# EAGLE design Audio-DAC-A (EAGLE 9.6.2)
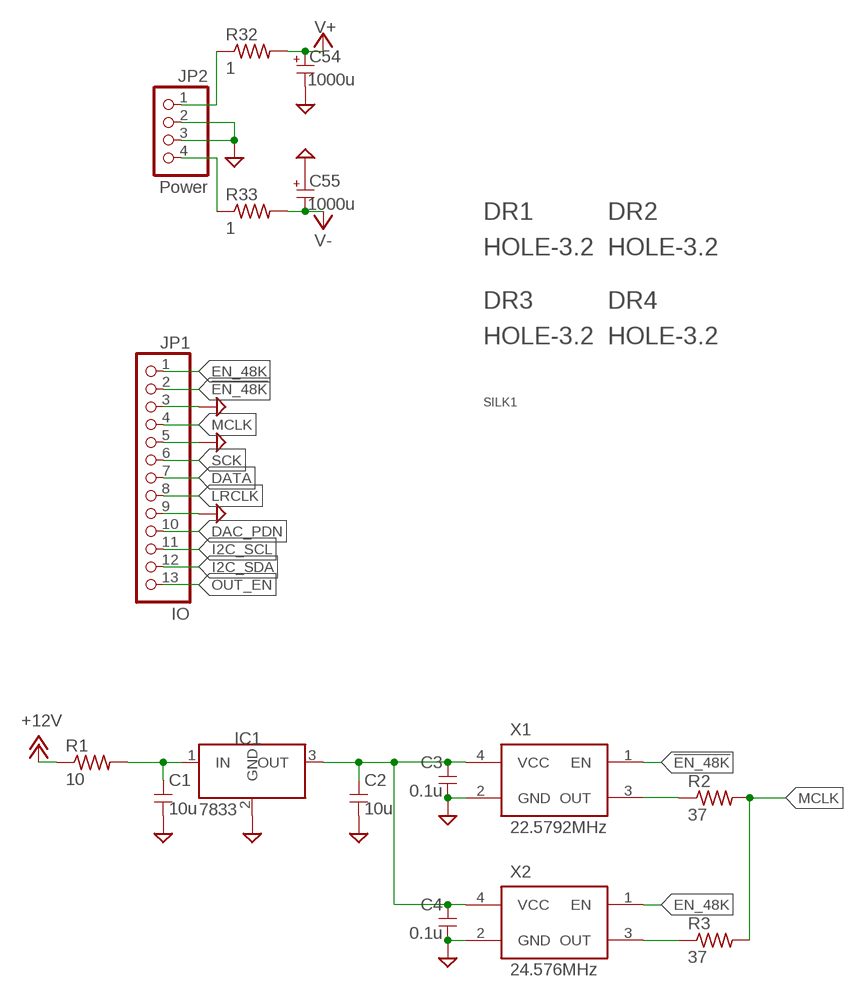
[diagram p0: schematic, sheet 1, part 1 of 2]
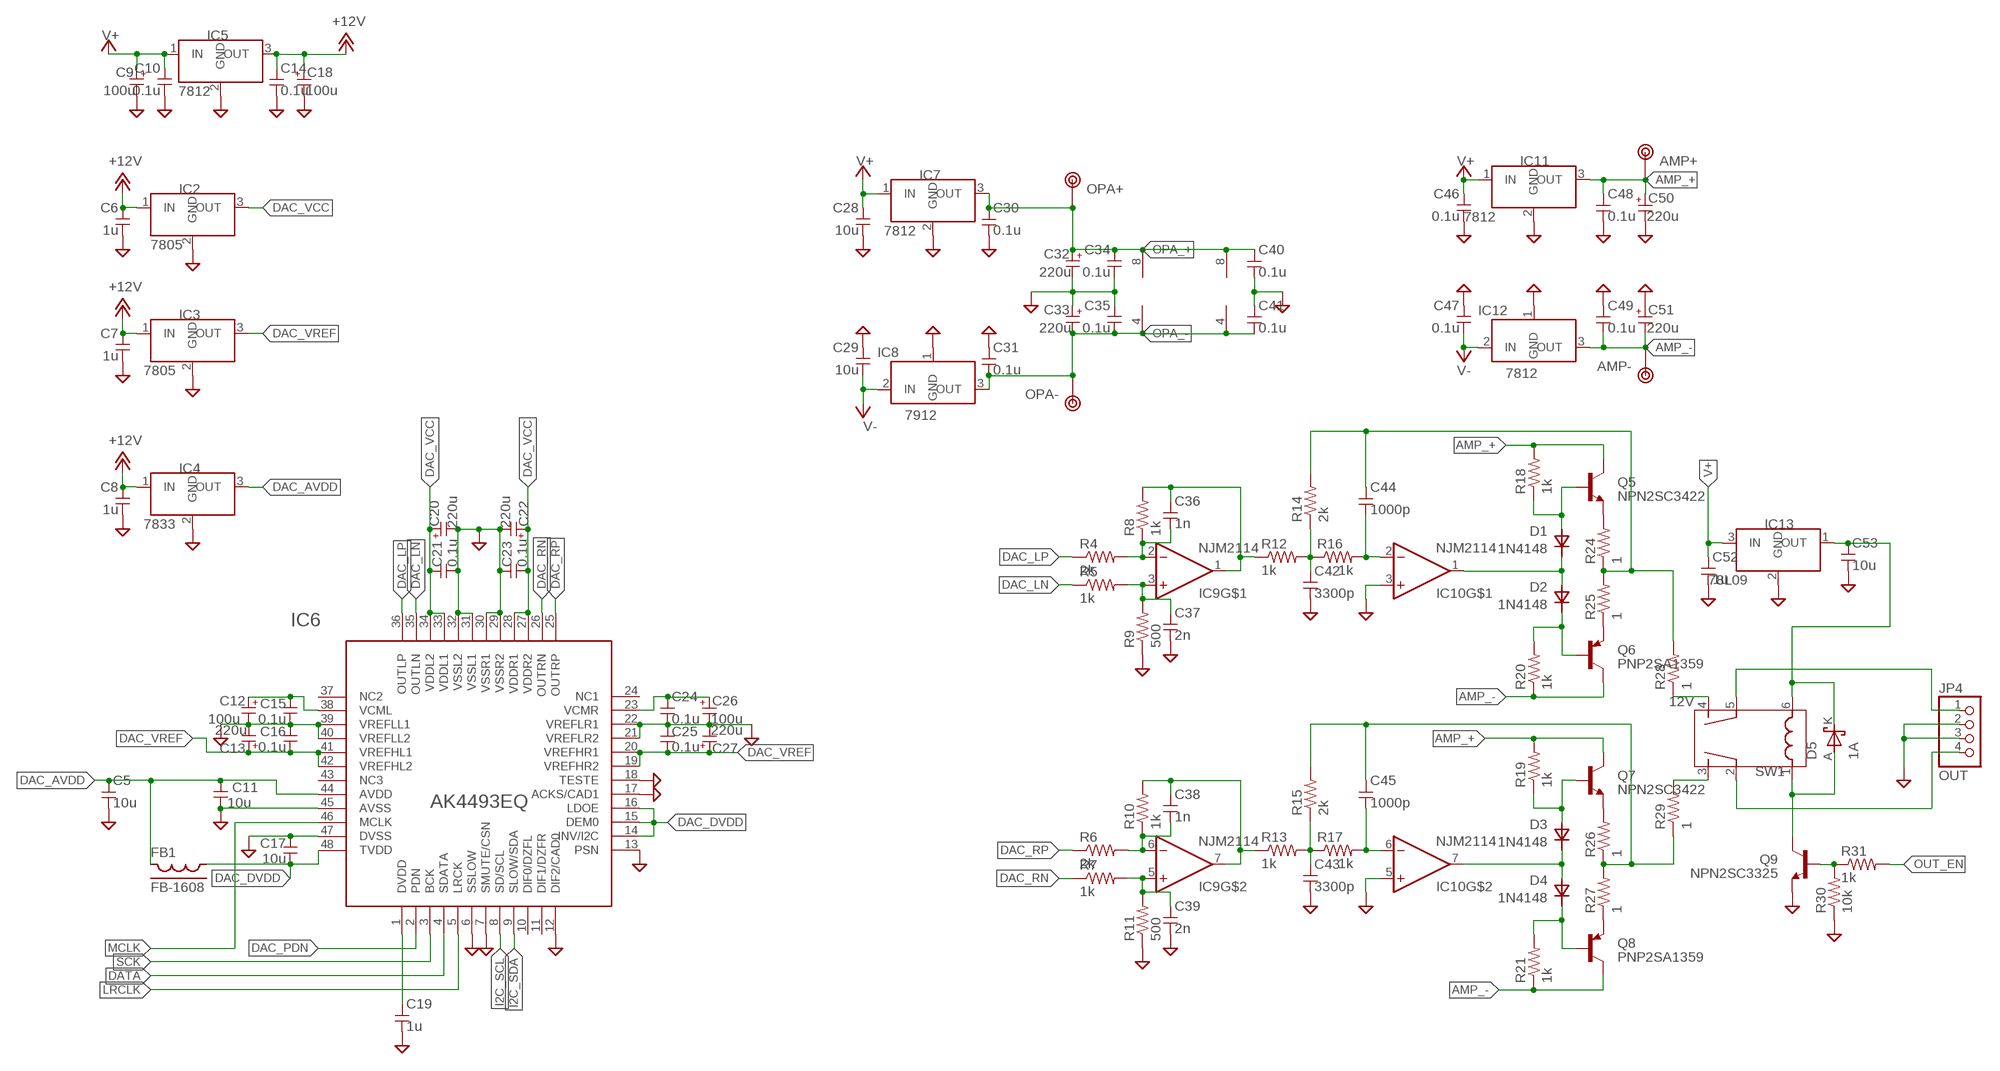
[diagram p1: schematic, sheet 1, part 2 of 2]

## Parts
C1  10u  C-2012  [2012]
C2  10u  C-2012  [2012]
C3  0.1u  C-1608  [1608]
C4  0.1u  C-1608  [1608]
C5  10u  C-2012  [2012]
C6  1u  C-1608  [1608]
C7  1u  C-1608  [1608]
C8  1u  C-1608  [1608]
C9  100u  CPOLE2.5-8  [E2,5-8]
C10  0.1u  C-1608  [1608]
C11  10u  C-1608  [1608]
C12  100u  CPOLE2.5-6.5  [E2.5-6.5]
C13  220u  CPOLE2.5-6.5  [E2.5-6.5]
C14  0.1u  C-1608  [1608]
C15  0.1u  C-1608  [1608]
C16  0.1u  C-1608  [1608]
C17  10u  C-1608  [1608]
C18  100u  CPOLE2.5-8  [E2,5-8]
C19  1u  C-1608  [1608]
C20  220u  CPOLE2.5-6.5  [E2.5-6.5]
C21  0.1u  C-1608  [1608]
C22  220u  CPOLE2.5-6.5  [E2.5-6.5]
C23  0.1u  C-1608  [1608]
C24  0.1u  C-1608  [1608]
C25  0.1u  C-1608  [1608]
C26  100u  CPOLE2.5-6.5  [E2.5-6.5]
C27  220u  CPOLE2.5-6.5  [E2.5-6.5]
C28  10u  C-1608  [1608]
C29  10u  C-1608  [1608]
C30  0.1u  C-1608  [1608]
C31  0.1u  C-1608  [1608]
C32  220u  CPOLE2.5-6.5  [E2.5-6.5]
C33  220u  CPOLE2.5-6.5  [E2.5-6.5]
C34  0.1u  C-1608  [1608]
C35  0.1u  C-1608  [1608]
C36  1n  C-1608  [1608]
C37  2n  C-1608  [1608]
C38  1n  C-1608  [1608]
C39  2n  C-1608  [1608]
C40  0.1u  C-1608  [1608]
C41  0.1u  C-1608  [1608]
C42  3300p  C-1608  [1608]
C43  3300p  C-1608  [1608]
C44  1000p  C-1608  [1608]
C45  1000p  C-1608  [1608]
C46  0.1u  C-1608  [1608]
C47  0.1u  C-1608  [1608]
C48  0.1u  C-1608  [1608]
C49  0.1u  C-1608  [1608]
C50  220u  CPOLE5-10  [E5-10]
C51  220u  CPOLE5-10  [E5-10]
C52  1u  C-1608  [1608]
C53  10u  C-2012  [2012]
C54  1000u  CPOLE5-10  [E5-10]
C55  1000u  CPOLE5-10  [E5-10]
D1  1N4148  DIODE-2  [D0207/2V]
D2  1N4148  DIODE-2  [D0207/2V]
D3  1N4148  DIODE-2  [D0207/2V]
D4  1N4148  DIODE-2  [D0207/2V]
D5  1A  SBD-1A  [TUMD2M]
DR1  HOLE-3.2  [HOLE_3.2]
DR2  HOLE-3.2  [HOLE_3.2]
DR3  HOLE-3.2  [HOLE_3.2]
DR4  HOLE-3.2  [HOLE_3.2]
FB1  FB-1608  [1608]
IC1  7833  78X-1  [7805-LARGEHOLE]
IC2  7805  78X-1  [7805-LARGEHOLE]
IC3  7805  78X-1  [7805-LARGEHOLE]
IC4  7833  78X-1  [7805-LARGEHOLE]
IC5  7812  78X-1  [7805-LARGEHOLE]
IC6  AK4493EQ  [LQFP48]
IC7  7812  78X-1  [7805-LARGEHOLE]
IC8  7912  79X-1  [7805-LARGEHOLE]
IC9  NJM2114  OPA-2'  [DIL08]
IC10  NJM2114  OPA-2'  [DIL08]
IC11  7812  78X-1  [7805-LARGEHOLE]
IC12  7812  79X-1  [7805-LARGEHOLE]
IC13  78L09  78LX  [TO-92]
JP1  IO  PINHD-1X13  [1X13]
JP2  Power  PINHD-1X4  [1X04]
JP4  OUT  PINHD-1X4  [1X04]
Q5  NPN2SC3422  [TO126]
Q6  PNP2SA1359  [TO126]
Q7  NPN2SC3422  [TO126]
Q8  PNP2SA1359  [TO126]
Q9  NPN2SC3325  [SC59]
R1  10  R-7.5  [0204/7]
R2  37  R-1608  [1608]
R3  37  R-1608  [1608]
R4  2k  R-2.5  [0207/2V]
R5  1k  R-2.5  [0207/2V]
R6  2k  R-2.5  [0207/2V]
R7  1k  R-2.5  [0207/2V]
R8  1k  R-2.5  [0207/2V]
R9  500  R-2.5  [0207/2V]
R10  1k  R-2.5  [0207/2V]
R11  500  R-2.5  [0207/2V]
R12  1k  R-2.5  [0207/2V]
R13  1k  R-2.5  [0207/2V]
R14  2k  R-2.5  [0207/2V]
R15  2k  R-2.5  [0207/2V]
R16  1k  R-2.5  [0207/2V]
R17  1k  R-2.5  [0207/2V]
R18  1k  R-2.5  [0207/2V]
R19  1k  R-2.5  [0207/2V]
R20  1k  R-2.5  [0207/2V]
R21  1k  R-2.5  [0207/2V]
R24  1  R-2.5  [0207/2V]
R25  1  R-2.5  [0207/2V]
R26  1  R-2.5  [0207/2V]
R27  1  R-2.5  [0207/2V]
R28  1  R-2.5  [0207/2V]
R29  1  R-2.5  [0207/2V]
R30  10k  R-1608  [1608]
R31  1k  R-7.5  [0204/7]
R32  1  R-10  [0207/10]
R33  1  R-10  [0207/10]
SILK1  ROBOTECHWHEELSILK-9MM  [ROBOTECHWHEEL-9MM]
SW1  12V  ALA2F  [ALA2F]
TP1  AMP+  TESTPIN  [TESTPIN]
TP2  AMP-  TESTPIN  [TESTPIN]
TP3  OPA-  TESTPIN  [TESTPIN]
TP4  OPA+  TESTPIN  [TESTPIN]
X1  22.5792MHz  OSC-KC7050  [KC7050]
X2  24.576MHz  OSC-KC7050  [KC7050]

## Nets
!EN_48K: JP1.2 X1.1(EN)
+12V: C6.1 C7.1 C8.1 C14.1 C18.+ IC2.1(IN) IC3.1(IN) IC4.1(IN) IC5.3(OUT) R1.1
AMP_+: C48.1 C50.+ IC11.3(OUT) Q5.2(C) Q7.2(C) R18.2 R19.2 TP1.1
AMP_-: C49.2 C51.- IC12.3(OUT) Q6.2(C) Q8.2(C) R20.1 R21.1 TP2.1
DAC_AVDD: C5.1 C11.1 FB1.2 IC4.3(OUT) IC6.44(AVDD)
DAC_DVDD: C17.2 FB1.1 IC6.14(INV/I2C) IC6.15(DEM0) IC6.16(LDOE) IC6.48(TVDD)
DAC_LN: IC6.35(OUTLN) R5.1
DAC_LP: IC6.36(OUTLP) R4.1
DAC_PDN: IC6.2(PDN) JP1.10
DAC_RN: IC6.26(OUTRN) R7.1
DAC_RP: IC6.25(OUTRP) R6.1
DAC_VCC: C20.+ C21.1 C22.+ C23.2 IC2.3(OUT) IC6.27(VDDR2) IC6.28(VDDR1) IC6.33(VDDL1) IC6.34(VDDL2)
DAC_VREF: C13.+ C16.2 C25.2 C27.+ IC3.3(OUT) IC6.19(VREFHR2) IC6.20(VREFHR1) IC6.41(VREFHL1) IC6.42(VREFHL2)
DATA: IC6.4(SDATA) JP1.7
EN_48K: JP1.1 X2.1(EN)
GND: C1.2 C2.2 C3.2 C4.2 C5.2 C6.2 C7.2 C8.2 C9.- C10.2 C11.2 C12.- C13.- C14.2 C15.2 C16.1 C17.1 C18.- C19.2 C20.- C21.2 C22.- C23.1 C24.2 C25.1 C26.- C27.- C28.2 C29.1 C30.2 C31.1 C32.- C33.+ C34.2 C35.1 C37.2 C39.2 C40.2 C41.1 C42.2 C43.2 C46.2 C47.1 C48.2 C49.1 C50.- C51.+ C52.2 C53.2 C54.- C55.+ IC1.2(GND) IC2.2(GND) IC3.2(GND) IC4.2(GND) IC5.2(GND) IC6.6(SSLOW) IC6.7(SMUTE/CSN) IC6.12(DIF2/CAD0) IC6.13(PSN) IC6.17(ACKS/CAD1) IC6.18(TESTE) IC6.21(VREFLR2) IC6.22(VREFLR1) IC6.29(VSSR2) IC6.30(VSSR1) IC6.31(VSSL1) IC6.32(VSSL2) IC6.39(VREFLL1) IC6.40(VREFLL2) IC6.45(AVSS) IC6.47(DVSS) IC7.2(GND) IC8.1(GND) IC10.3(+IN) IC10.5(+IN) IC11.2(GND) IC12.1(GND) IC13.2(GND) JP1.3 JP1.5 JP1.9 JP2.2 JP2.3 JP4.2 JP4.3 Q9.2(E) R9.1 R11.1 R30.1 X1.2(GND) X2.2(GND)
I2C_SCL: IC6.8(SD/SCL) JP1.11
I2C_SDA: IC6.9(SLOW/SDA) JP1.12
LRCLK: IC6.5(LRCK) JP1.8
MCLK: IC6.46(MCLK) JP1.4 R2.2 R3.2
N$1: JP2.1 R32.1
N$2: JP2.4 R33.1
N$3: C39.1 IC9.5(+IN) R7.2 R11.2
N$8: D3.1(A) Q7.3(B) R19.1
N$9: D3.2(K) D4.1(A) IC10.7(OUT)
N$10: D4.2(K) Q8.3(B) R21.2
N$13: C12.+ C15.1 IC6.38(VCML)
N$14: R29.2 SW1.3(A1)
N$20: Q7.1(E) R26.2
N$21: C38.2 IC9.6(-IN) R6.2 R10.1
N$22: C19.1 IC6.1(DVDD)
N$23: C24.1 C26.+ IC6.23(VCMR)
N$28: Q8.1(E) R27.1
N$29: C45.1 R15.2 R26.1 R27.2 R29.1
N$30: Q6.1(E) R25.1
N$31: Q5.1(E) R24.2
N$32: C44.1 R14.2 R24.1 R25.2 R28.2
N$41: C38.1 IC9.7(OUT) R10.2 R13.1
N$42: C37.1 IC9.3(+IN) R5.2 R9.2
N$43: C36.2 IC9.2(-IN) R4.2 R8.1
N$44: C36.1 IC9.1(OUT) R8.2 R12.1
N$45: C42.1 R12.2 R14.1 R16.1
N$46: C43.1 R13.2 R15.1 R17.1
N$47: C45.2 IC10.6(-IN) R17.2
N$48: C44.2 IC10.2(-IN) R16.2
N$60: D1.1(A) Q5.3(B) R18.1
N$62: R28.1 SW1.4(A2)
N$63: C53.1 D5.K IC13.1(OUT) SW1.6(L2)
N$64: D2.2(K) Q6.3(B) R20.2
N$65: JP4.4 SW1.2(COM1)
N$66: D5.A Q9.3(C) SW1.1(L1)
N$67: JP4.1 SW1.5(COM2)
N$68: Q9.1(B) R30.2 R31.1
N$75: D1.2(K) D2.1(A) IC10.1(OUT)
N$83: R2.1 X1.3(OUT)
N$86: R3.1 X2.3(OUT)
N$91: C1.1 IC1.1(IN) R1.2
OPA_+: C30.1 C32.+ C34.1 C40.1 IC7.3(OUT) IC9.8(V+) IC10.8(V+) TP4.1
OPA_-: C31.2 C33.- C35.2 C41.2 IC8.3(OUT) IC9.4(V-) IC10.4(V-) TP3.1
OUT_EN: JP1.13 R31.2
SCK: IC6.3(BCK) JP1.6
V+: C9.+ C10.1 C28.1 C46.1 C52.1 C54.+ IC5.1(IN) IC7.1(IN) IC11.1(IN) IC13.3(IN) R32.2
V-: C29.2 C47.2 C55.- IC8.2(IN) IC12.2(IN) R33.2
XTAL_VCC: C2.1 C3.1 C4.1 IC1.3(OUT) X1.4(VCC) X2.4(VCC)
Unconnected: IC6.10(DIF0/DZFL) IC6.11(DIF1/DZFR) IC6.24(NC1) IC6.37(NC2) IC6.43(NC3)

## Library data of the parts
C1-C8 C10 C11 C14-C17 C19 C21 C23-C25 C28-C31 C34-C49 C52 C53 = my_rcl:C
C9 C12 C13 C18 C20 C22 C26 C27 C32 C33 C50 C51 C54 C55 = my_rcl:CPOL
D1-D4 = my_rcl:DIODE
D5 = my_rcl:SBD
DR1-DR4 = my_connector:HOLE-3.2
FB1 = my_rcl:FB
IC1-IC5 IC7 IC11 = my_ic:78X
IC6 = my_ic:AK4493EQ
IC8 IC12 = my_ic:79X
IC9 IC10 = my_ic:OPA-2
IC13 = my_ic:78LX
JP1 = pinhead:PINHD-1X13: PIN HEADER
JP2 JP4 = pinhead:PINHD-1X4: PIN HEADER
Q5 Q7 Q9 = my_ic:NPN
Q6 Q8 = my_ic:PNP
R1-R21 R24-R33 = my_rcl:R
SILK1 = Document_Robotech:ROBOTECHWHEEL
SW1 = my_rcl:ALA2F
TP1-TP4 = my_connector:TESTPIN
X1 X2 = my_rcl:OSC

## Board
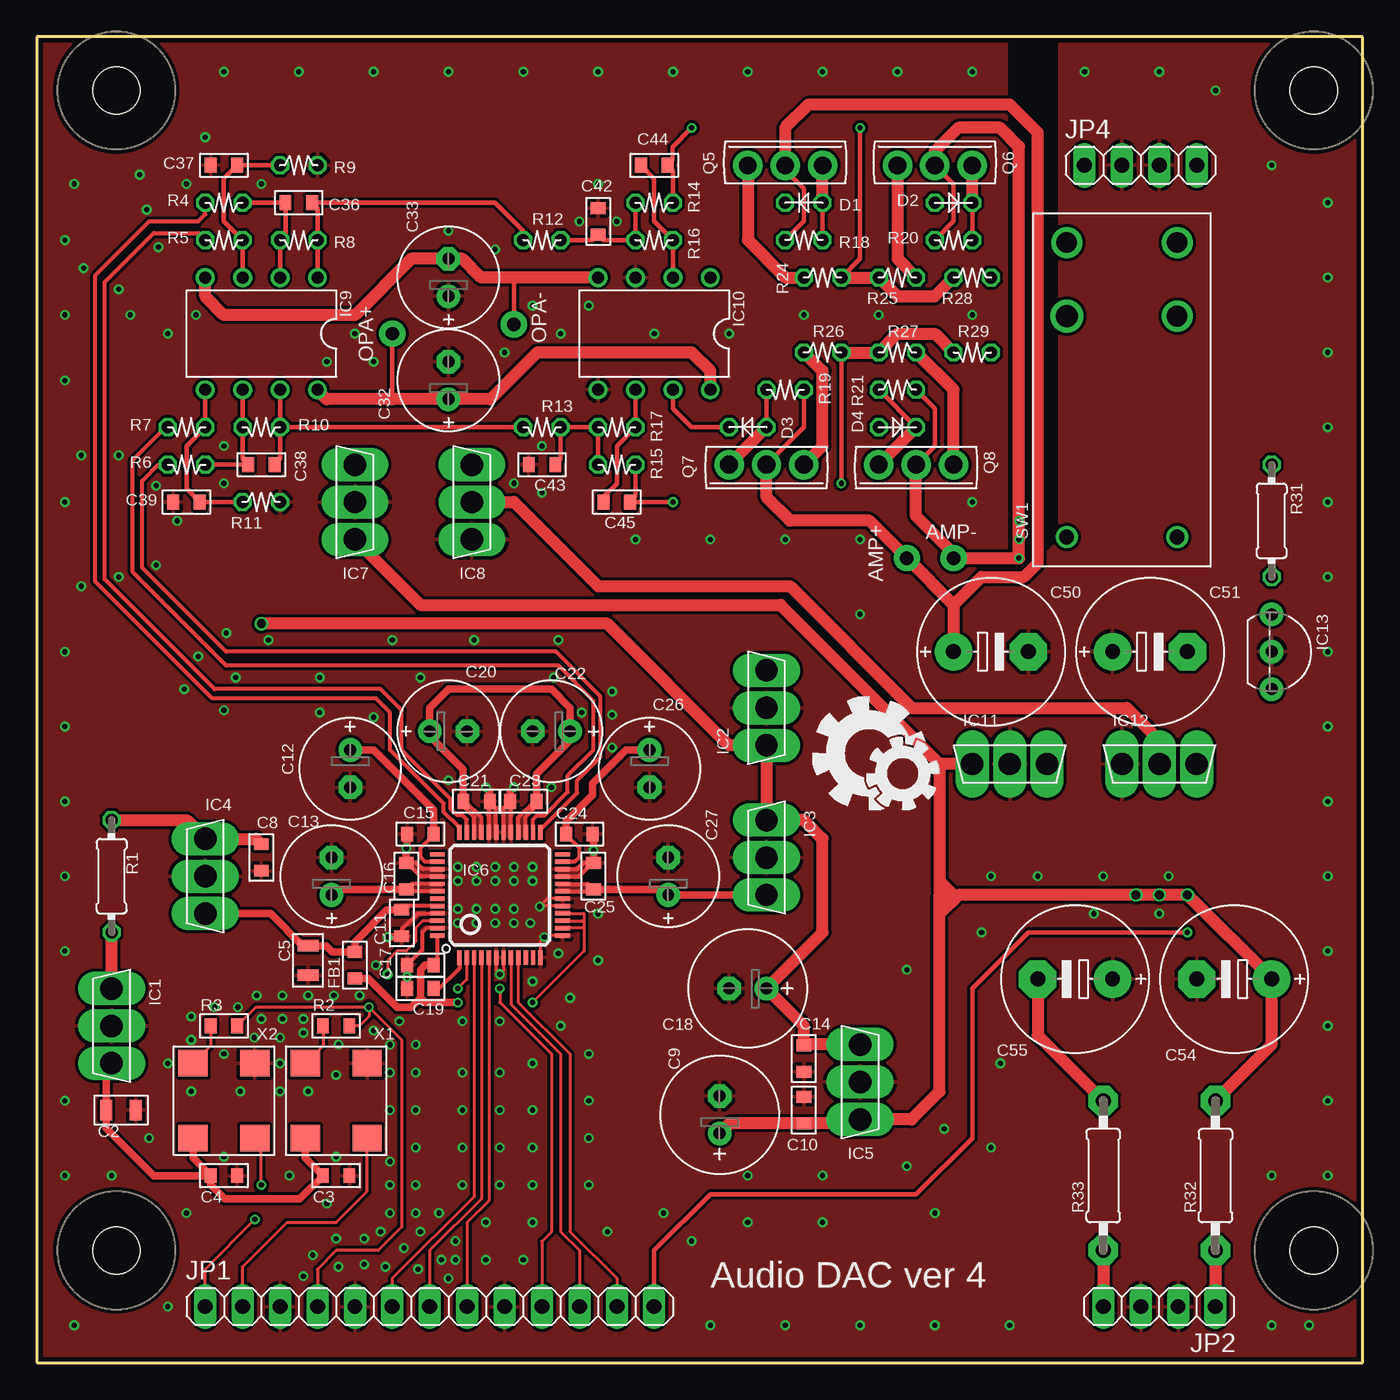
[diagram p2: board, top side]
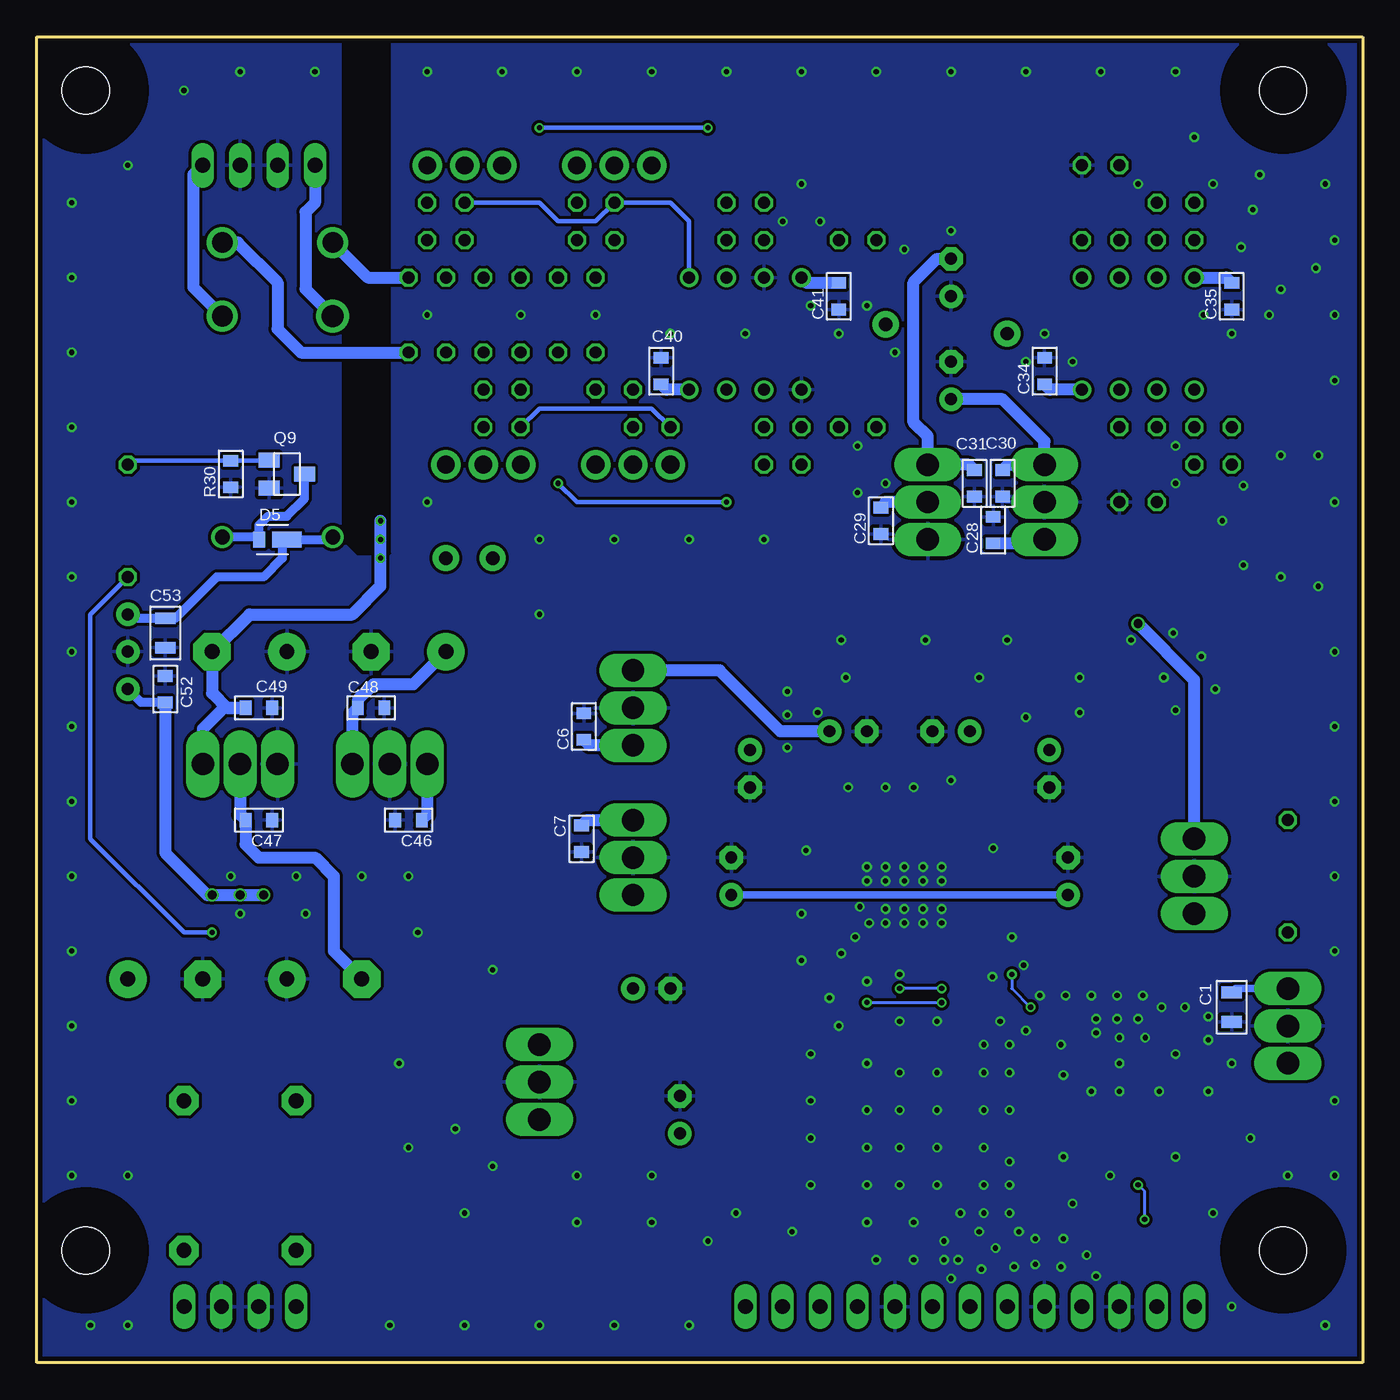
[diagram p3: board, bottom side, seen from below]

Size 90 x 90 mm. Coordinates in mm from the lower left corner, seen from the top.
Outline: 0,0 90,0 90,90 0,90 0,0
Copper layers (1*16): Top 0.035mm / dielectric 1.5mm / Bottom 0.035mm
Design rules "SeeedStudio_2layer_DRU_20140221 *": minimum track width 6mil, minimum drill 0.3mm, track to track 8mil, track to pad 7mil, pad to pad 7mil, via to via 12mil, smd to smd 0mil, copper to edge 0.3mm, drill to drill 10mil, minimum pad ring 0.15mm, minimum via ring 6mil, stop-mask expansion 2mil, vias tented up to drill 1mm, thermal gap 10mil
tRestrict: 12 lines

### Footprints (pad centres in the part's own frame; a part is rotated, then mirrored left to right if it is on the bottom)
2012 = smd 0.8 x 1.4: 1 -1,0; 2 1,0
1608 = smd 0.8 x 1: 1 -0.9,0; 2 0.9,0
E2,5-8 = drill 0.813 pad 1.6: + -1.27,0 | drill 0.813 pad 1.6 octagon: - 1.27,0
E2.5-6.5 = drill 0.813 pad 1.6: + -1.27,0 | drill 0.813 pad 1.6 octagon: - 1.27,0
E5-10 = drill 1.016 pad 2.54: + -2.54,0 | drill 1.016 pad 2.54 octagon: - 2.54,0
D0207/2V = drill 0.813 octagon: 1 -1.27,0; 2 1.27,0
TUMD2M = smd 0.8 x 1.1: A -1.25,0 | smd 2 x 1.1: K 0.65,0
HOLE_3.2 = hole 3.2: 0,0
7805-LARGEHOLE = drill 1.524 pad 2.032 long: 1 -2.54,0; 2 0,0; 3 2.54,0
LQFP48 = smd 0.3 x 1: 1 -2.75,-4.25; 2 -2.25,-4.25; 3 -1.75,-4.25; 4 -1.25,-4.25; 5 -0.75,-4.25; 6 -0.25,-4.25; 7 0.25,-4.25; 8 0.75,-4.25; 9 1.25,-4.25; 10 1.75,-4.25; 11 2.25,-4.25; 12 2.75,-4.25; 25 2.75,4.25; 26 2.25,4.25; 27 1.75,4.25; 28 1.25,4.25; 29 0.75,4.25; 30 0.25,4.25; 31 -0.25,4.25; 32 -0.75,4.25; 33 -1.25,4.25; 34 -1.75,4.25; 35 -2.25,4.25; 36 -2.75,4.25 | smd 1 x 0.3: 13 4.25,-2.75; 14 4.25,-2.25; 15 4.25,-1.75; 16 4.25,-1.25; 17 4.25,-0.75; 18 4.25,-0.25; 19 4.25,0.25; 20 4.25,0.75; 21 4.25,1.25; 22 4.25,1.75; 23 4.25,2.25; 24 4.25,2.75; 37 -4.25,2.75; 38 -4.25,2.25; 39 -4.25,1.75; 40 -4.25,1.25; 41 -4.25,0.75; 42 -4.25,0.25; 43 -4.25,-0.25; 44 -4.25,-0.75; 45 -4.25,-1.25; 46 -4.25,-1.75; 47 -4.25,-2.25; 48 -4.25,-2.75
DIL08 = drill 0.813 pad 1.27: 1 -3.81,-3.81; 2 -1.27,-3.81; 3 1.27,-3.81; 4 3.81,-3.81; 5 3.81,3.81; 6 1.27,3.81; 7 -1.27,3.81; 8 -3.81,3.81
TO-92 = drill 0.813 pad 1.6: 1 -2.54,0; 2 0,0; 3 2.54,0
1X13 = drill 1.016 long: 1 -15.24,0; 2 -12.7,0; 3 -10.16,0; 4 -7.62,0; 5 -5.08,0; 6 -2.54,0; 7 0,0; 8 2.54,0; 9 5.08,0; 10 7.62,0; 11 10.16,0; 12 12.7,0; 13 15.24,0
1X04 = drill 1.016 long: 1 -3.81,0; 2 -1.27,0; 3 1.27,0; 4 3.81,0
TO126 = drill 1.2 pad 2: 1 -2.54,0; 2 0,0; 3 2.54,0
SC59 = smd 1 x 1.4: 1 -0.95,-1.2; 2 0.95,-1.2; 3 0,1.2
0204/7 = drill 0.813 octagon: 1 -3.81,0; 2 3.81,0
0207/2V = drill 0.813 octagon: 1 -1.27,0; 2 1.27,0
0207/10 = drill 1 pad 2 octagon: 1 -5.08,0; 2 5.08,0
ALA2F = drill 1: 1 -10,-3.75; 6 -10,3.75 | drill 1.4: 2 5,-3.75; 3 10,-3.75; 4 10,3.75 | drill 1.5: 5 5,3.75
TESTPIN = drill 0.9 pad 1.778: 1 0,0
KC7050 = smd 1.8 x 2: 1 -2.54,-2.1; 2 2.54,-2.1; 3 2.54,2.1; 4 -2.54,2.1

### Placement (x,y rotation side)
C1  8.89,24.13 270 bottom
C2  5.71,17.14 0 top
C3  20.32,12.7 0 top
C4  12.7,12.7 0 top
C5  18.41,27.3 270 top
C6  52.86,43.18 90 bottom
C7  53.02,35.56 270 bottom
C8  15.24,34.29 270 top
C9  46.35,16.83 90 top
C10  52.07,17.14 90 top
C11  24.77,29.84 270 top
C12  21.27,40.32 270 top
C13  20,33.02 90 top
C14  52.07,20.64 270 top
C15  26.04,35.88 180 top
C16  25.08,33.02 270 top
C17  26.04,26.99 0 top
C18  48.26,25.4 180 top
C19  26.04,25.4 180 top
C20  27.94,42.86 0 top
C21  29.84,38.1 0 top
C22  34.92,42.86 180 top
C23  33.02,38.1 0 top
C24  36.83,35.88 0 top
C25  37.78,33.02 270 top
C26  41.59,40.32 270 top
C27  42.86,33.02 90 top
C28  25.08,56.52 90 bottom
C29  32.7,57.15 90 bottom
C30  24.45,59.69 270 bottom
C31  26.35,59.69 90 bottom
C32  27.94,66.67 90 top
C33  27.94,73.66 90 top
C34  21.59,67.31 90 bottom
C35  8.89,72.39 90 bottom
C36  17.78,78.74 180 top
C37  12.7,81.28 180 top
C38  15.24,60.96 180 top
C39  10.16,58.42 180 top
C40  47.62,67.31 90 bottom
C41  35.56,72.39 90 bottom
C42  38.1,77.47 90 top
C43  34.29,60.96 180 top
C44  41.91,81.28 180 top
C45  39.37,58.42 180 top
C46  64.77,36.83 180 bottom
C47  74.93,36.83 180 bottom
C48  67.31,44.45 0 bottom
C49  74.93,44.45 180 bottom
C50  64.77,48.26 0 top
C51  75.56,48.26 0 top
C52  81.28,45.72 90 bottom
C53  81.28,49.53 270 bottom
C54  81.28,26.04 180 top
C55  70.48,26.04 180 top
D1  52.07,78.74 180 top
D2  62.23,78.74 0 top
D3  48.26,63.5 180 top
D4  58.42,63.5 0 top
D5  73.66,55.88 0 bottom
DR1  5.4,7.62 0 top
DR2  86.68,7.62 0 top
DR3  5.4,86.36 0 top
DR4  86.68,86.36 0 top
FB1  21.59,26.99 90 top
IC1  5.08,22.86 270 top
IC2  49.53,44.45 90 top
IC3  49.53,34.29 270 top
IC4  11.43,33.02 270 top
IC5  55.88,19.05 90 top
IC6  31.43,31.75 0 top
IC7  21.59,58.42 90 top
IC8  29.53,58.42 90 top
IC9  15.24,69.85 180 top
IC10  41.91,69.85 180 top
IC11  66.04,40.64 0 top
IC12  76.2,40.64 0 top
IC13  83.82,48.26 270 top
JP1  26.67,3.81 0 top
JP2  76.2,3.81 180 top
JP4  74.93,81.28 0 top
Q5  50.8,81.28 0 top
Q6  60.96,81.28 0 top
Q7  49.53,60.96 180 top
Q8  59.69,60.96 180 top
Q9  73.03,60.33 270 bottom
R1  5.08,33.02 270 top
R2  20.32,22.86 0 top
R3  12.7,22.86 0 top
R4  12.7,78.74 0 top
R5  12.7,76.2 0 top
R6  10.16,60.96 0 top
R7  10.16,63.5 0 top
R8  17.78,76.2 0 top
R9  17.78,81.28 180 top
R10  15.24,63.5 0 top
R11  15.24,58.42 180 top
R12  34.29,76.2 0 top
R13  34.29,63.5 0 top
R14  41.91,78.74 0 top
R15  39.37,60.96 0 top
R16  41.91,76.2 0 top
R17  39.37,63.5 0 top
R18  52.07,76.2 180 top
R19  50.8,66.04 0 top
R20  62.23,76.2 0 top
R21  58.42,66.04 180 top
R24  53.34,73.66 180 top
R25  58.42,73.66 180 top
R26  53.34,68.58 180 top
R27  58.42,68.58 180 top
R28  63.5,73.66 180 top
R29  63.5,68.58 0 top
R30  76.83,60.33 90 bottom
R31  83.82,57.15 270 top
R32  80.01,12.7 90 top
R33  72.39,12.7 90 top
SILK1  52.55,37.31 0 top
SW1  73.66,66.04 90 top
TP1  59.05,54.61 0 top
TP2  62.23,54.61 0 top
TP3  32.38,70.48 0 top
TP4  24.13,69.85 0 top
X1  20.32,17.78 90 top
X2  12.7,17.78 90 top

### Tracks (layer width: path | path; a pad name or v marks a point on that pad's centre or on a via)
!EN_48K
  Top 0.203: JP1.2 13.97,6.51 16.99,9.53 20.32,9.53 22.42,11.62 X1.1
+12V  (via drill 0.6)
  Top 0.813: R1.1 10.16,36.83 IC4.1 14.87,35.56 C8.1 | v15.24,50.16 38.73,50.16 46.99,41.91 IC2.1 IC3.1 52.07,36.83 53.34,35.56 53.34,29.21 C18.+ 52.07,22.86 C14.1 52.12,21.59 IC5.3
  Bottom 0.813: IC4.1 11.43,46.35 v15.24,50.16 | C7.1 52.65,36.83 IC3.1 | IC2.1 52.49,41.91 C6.1
AMP_+
  Top 0.305: Q5.2 50.8,80.96 52.07,79.69 52.07,77.47 R18.2 | R19.2 52.07,63.5 Q7.2
  Top 0.813: Q7.2 49.53,58.74 51.12,57.15 56.52,57.15 TP1.1 62.23,51.44 | Q5.2 50.8,83.82 52.39,85.41 66.04,85.41 67.94,83.5 67.94,54.29 66.99,53.34 64.14,53.34 62.23,51.44 | 62.23,51.44 C50.+
  Bottom 0.813: IC11.3 68.58,44.08 C48.1 68.21,44.98 67.15,46.04 64.45,46.04 C50.+
AMP_-  (via drill 0.35)
  Top 0.305: R20.1 62.23,77.47 62.23,80.01 Q6.2 | R21.1 60.96,64.77 60.96,62.23 Q8.2
  Top 0.813: Q8.2 59.69,57.47 62.23,54.93 TP2.1 v66.67,54.61 v66.67,55.88 v66.67,57.15 66.67,82.55 65.41,83.82 62.55,83.82 60.96,82.23 Q6.2
  Bottom 0.813: IC12.3 78.74,43.02 77.31,44.45 C49.2 77.1,44.45 78.11,45.45 C51.- 75.56,50.8 68.58,50.8 66.67,52.7 v66.67,54.61 v66.67,55.88 v66.67,57.15
DAC_AVDD
  Top 0.279: IC6.44 24.97,31 24.77,30.8 C11.1
  Top 0.508: C11.1 23.76,30.75 21.59,28.57 FB1.2 20.05,27.89 19.64,28.3 C5.1 18.05,28.3 15.88,30.48 IC4.3
DAC_DVDD  (via drill 0.35)
  Top 0.203: IC6.14 37.12,29.5 37.15,29.53 | IC6.16 37.13,30.5 37.15,30.48 37.15,29.84 | 37.15,29.84 37.15,29.53 | IC6.15 36.99,30 37.15,29.84 | v33.66,24.45 37.15,27.94 37.15,29.53
  Top 0.279: IC6.48 27.18,27.23
  Top 0.305: 27.18,27.23 C17.2
  Top 0.508: C17.2 26.35,26.99 26.04,26.67 26.04,24.77 | 26.04,24.77 25.4,24.13 24.45,24.13 22.49,26.09 FB1.1 | v28.57,24.44 26.36,24.44 26.04,24.77
  Bottom 0.203: v28.57,24.44 28.58,24.45 v33.66,24.45
DAC_LN
  Top 0.279: IC6.35 29.18,36.86 28.89,37.15 28.55,37.15 28.1,37.6 28.1,38.26 24.77,41.59 24.77,44.29 23.34,45.72 12.06,45.72 4.6,53.18 4.6,73.34 7.94,76.68 10.95,76.68 R5.1
DAC_LP
  Top 0.279: IC6.36 28.68,36.33 27.62,37.4 27.62,37.95 23.97,41.59 23.97,44.13 23.02,45.09 11.91,45.09 3.97,53.02 3.97,73.82 7.62,77.47 10.95,77.47 11.43,77.95 R4.1
DAC_PDN  (via drill 0.35)
  Top 0.203: IC6.2 29.18,26.01 v28.57,25.4 | v31.43,25.4 31.43,24.45 34.92,20.95 34.92,8.89 34.29,8.26 JP1.10
  Bottom 0.203: v28.57,25.4 v31.43,25.4
DAC_RN
  Top 0.279: IC6.26 33.68,36.86 33.97,37.15 34.45,37.15 36.04,38.73 36.04,39.85 37.78,41.59 37.78,44.93 35.4,47.31 12.86,47.31 6.51,53.66 6.51,61.28 8.73,63.5 R7.1
DAC_RP
  Top 0.279: IC6.25 34.18,36.2 36.67,38.69 36.67,39.53 38.27,41.12 38.27,45.24 35.24,48.26 12.86,48.26 7.14,53.98 7.14,59.85 8.26,60.96 R6.1
DAC_VCC
  Top 0.279: IC6.34 29.68,37.05 28.95,37.78 C21.1 29.08,38.1 30.18,37 IC6.33 | IC6.27 33.18,37.05 33.92,37.78 C23.2 33.79,38.1 32.68,37 IC6.28
  Top 0.508: C21.1 28.95,40.27 26.67,42.55 C20.+ 26.67,44.45 27.94,45.72 34.92,45.72 36.2,44.45 C22.+ 36.2,42.23 33.92,39.95 C23.2
  Bottom 0.813: C22.+ 39.53,42.86 43.66,46.99 IC2.3
  pour Top (no thermals): 32.7,35.72 33.18,35.72 33.18,37.15 33.66,37.62 33.5,37.62 33.34,37.62 32.7,36.99 32.7,35.88
  pour Top (no thermals): 29.69,35.72 30,35.72 30,37.15 29.37,37.78 29.05,37.78 29.69,37.15
DAC_VREF
  Top 0.279: IC6.41 25.46,32.5 C16.2 25.2,32 IC6.42 | IC6.19 37.66,32 C25.2 37.4,32.5 IC6.20
  Top 0.508: C16.2 20.37,32.12 C13.+ | C25.2 42.49,32.12 C27.+ IC3.3
  Bottom 0.508: C27.+ 35.56,31.75 C13.+
  pour Top (no thermals): 27.46,32.07 27.46,32.38 25.56,32.38 25.56,32.07
  pour Top (no thermals): 35.4,32.38 35.4,32.07 37.31,32.07 37.31,32.38
DATA
  Top 0.203: IC6.4 30.18,11.13 26.67,7.62 JP1.7
EN_48K  (via drill 0.35)
  Top 0.203: JP1.1 11.43,6.35 v14.8,9.72 | v15.24,12.06 15.24,14.8 X2.1
  Bottom 0.203: v14.8,9.72 14.8,11.62 v15.24,12.06
GND  (via drill 0.35)
  Top 0.203: IC6.17 34.17,31 | 34.17,31 v34.13,30.96 | IC6.18 34.67,31.5 34.17,31 | IC6.13 34.56,29 v34.45,28.89 34.18,28.63 IC6.12 | IC6.7 31.68,26.6 v31.43,26.35 | v31.43,26.35 v31.43,26.36 | IC6.6 31.18,26.6 v31.43,26.35
  Top 0.279: IC6.45 27.15,30.47 25.84,30.47 24.77,29.4 24.77,29.21 | IC6.47 26.45,29.5 26.16,29.21 26.16,28.02 C17.1 | IC6.39 26.19,33.5 25.72,33.97 25.4,33.97 | 25.4,33.97 25.14,33.97 C16.1 | IC6.40 26.05,33 25.4,33.66 25.4,33.97 | IC6.21 36.81,33 37.73,33.92 C25.1 37.73,33.97 37.15,33.97 36.67,33.5 IC6.22 | IC6.32 30.68,38.04 C21.2 31.18,37.66 IC6.31 | IC6.30 31.68,37.66 C23.1 32.18,38.04 IC6.29
  Top 0.305: 24.77,29.21 C11.2
  Top 0.508: C21.2 30.75,38.79 v30.48,39.05 | C23.1 32.12,38.79 v32.38,39.05 | C16.1 v25.08,34.92 25.14,34.98 C15.2 | C11.2 24.71,28.89 v23.81,28.89 | C17.1 v25.14,26.19 C19.2 | C25.1 v37.78,34.77 37.78,35.83 C24.2
  other vias: 29.84,33.66 31.11,33.66 32.38,33.66 32.38,32.7 31.11,32.7 29.84,32.7 29.84,30.8 31.11,30.8 32.38,30.8 32.38,29.84 31.11,29.84 29.84,29.84 33.66,33.66 33.66,32.7 28.57,33.66 28.57,32.7 28.57,30.8 28.57,29.84 33.5,29.84 35.4,27.78 33.66,25.88 31.43,23.18 31.43,19.68 31.43,17.14 31.43,14.61 31.43,12.06 30.48,9.53 30.48,6.99 28.42,6.99 28.42,8.26 27.46,6.99 25.88,6.35 28.89,23.18 28.89,19.68 28.89,17.14 28.89,14.61 28.89,12.06 27.3,10.16 26.04,8.89 24.92,7.78 23.65,6.51 23.02,26.99 21.91,24.92 24.61,23.18 22.86,22.54 25.72,21.59 25.72,19.68 25.72,17.14 25.72,14.61 25.72,12.06 25.72,10.16 23.97,21.59 23.97,19.68 23.97,17.14 23.97,13.65 23.97,12.06 23.97,10.16 23.34,8.89 22.23,8.41 22.23,6.67 20.48,6.51 20.32,8.41 18.73,7.3 18.1,5.87 27.94,5.71 18.1,22.38 20.16,24.92 18.41,24.92 16.67,24.92 14.92,24.92 13.65,24.13 15.24,23.34 16.67,23.34 18.1,23.34 20.48,21.59 20.32,19.53 18.41,18.41 16.51,18.41 16.51,22.07 13.81,18.41 12.7,20.95 10.48,18.41 16.51,20.32 8.89,20.32 10.48,21.91 10.48,23.5 12.06,24.13 14.76,22.07 36.99,44.13 35.08,46.51 26.04,46.51 19.21,46.51 13.49,46.51 10.95,47.94 5.56,53.34 5.56,61.59 5.56,72.87 8.26,75.72 7.46,78.26 3.17,74.3 3.02,61.59 3.02,52.7 10,45.72 12.7,44.29 19.21,44.13 22.86,43.81 27.94,39.53 34.92,39.05 39.05,41.75 39.05,43.97 39.05,45.56 35.4,49.05 29.69,49.05 24.13,49.05 15.72,49.05 12.86,49.53 8.1,54.13 8.1,59.53 33.66,12.06 33.66,9.53 33.02,6.99 37.47,12.06 33.66,14.61 33.66,17.14 33.66,20.32 35.56,22.86 37.47,20.95 37.47,17.78 37.47,15.24 38.73,8.89 42.55,10.16 44.45,8.26 48.26,12.7 48.26,9.53 53.34,9.53 53.34,12.7 59.05,13.34 60.96,10.16 64.77,14.61 61.59,15.88 65.41,20.32 59.05,26.67 9.53,57.15 12.7,59.69 12.7,62.23 19.68,67.94 21.59,69.85 6.35,71.12 8.89,69.85 10.79,71.12 10.16,80.01 11.43,83.19 15.24,80.01 71.75,30.48 76.2,30.48 64.14,29.21 72.39,33.02 76.83,33.02 67.94,33.02 64.77,33.02 33.66,71.75 31.75,68.58 22.86,67.94 27.94,76.83 31.11,75.56 35.56,69.85 37.47,71.75 40.64,55.88 34.29,59.05 32.38,59.69 34.29,62.23 39.37,77.47 38.1,80.01 36.83,77.47 8.89,3.81 45.72,2.54 50.8,2.54 55.88,2.54 60.96,2.54 66.04,2.54 83.82,2.54 86.36,2.54 83.82,12.7 87.63,12.7 87.63,17.78 87.63,22.86 87.63,27.94 87.63,33.02 87.63,38.1 87.63,43.18 87.63,48.26 87.63,53.34 87.63,58.42 87.63,63.5 87.63,68.58 87.63,73.66 87.63,78.74 83.82,81.28 80.01,86.36 76.2,87.63 71.12,87.63 63.5,87.63 58.42,87.63 53.34,87.63 48.26,87.63 43.18,87.63 38.1,87.63 33.02,87.63 27.94,87.63 22.86,87.63 17.78,87.63 12.7,87.63 6.99,80.64 2.54,80.01 1.91,76.2 1.91,71.12 1.91,66.67 1.91,58.42 1.91,48.26 1.91,43.18 1.91,38.1 1.91,33.02 1.91,27.94 1.91,17.78 1.91,12.7 5.08,12.7 10.16,10.16 2.54,2.54 41.91,69.85 46.99,69.85 52.07,71.12 57.15,71.12 63.5,71.12 63.5,58.42 45.72,55.88 50.8,55.88 55.88,55.88 55.88,50.8 19.68,10.79 12.7,13.97 20.32,13.97 17.14,12.7 7.62,15.24 36.2,24.77 38.1,27.3 38.1,30.48
  pour Bottom (isolate 0.203, rank 6): 0,90.17 0,0 90.17,0 90.17,90.17
  pour Top (isolate 0.203, rank 6): 0,0 0,90.17 90.17,90.17 90.17,0
  pour Top (no thermals): 27.46,33.02 27.46,33.5 26.04,33.5 25.72,33.81 25.4,33.81 26.19,33.02
  pour Top (no thermals): 35.4,33.5 35.4,33.02 36.83,33.02 37.62,33.81 37.15,33.81 36.83,33.5
  pour Top (no thermals): 31.75,35.72 32.07,35.72 32.07,37.62 31.75,37.62
  pour Top (no thermals): 30.8,35.72 31.11,35.72 31.11,37.62 30.8,37.62 30.8,35.88
  cutout Bottom: 66.04,90.81 69.22,90.81 69.22,55.88 68.26,54.93 66.04,54.93
  cutout Top: 66.04,90.81 69.22,90.81 69.22,55.88 67.63,54.29 66.04,54.29
I2C_SCL
  Top 0.203: IC6.8 32.18,24.33 35.56,20.95 35.56,8.89 36.83,7.62 JP1.11
I2C_SDA
  Top 0.203: IC6.9 32.68,24.47 36.2,20.95 36.2,8.89 39.37,5.71 JP1.12
LRCLK
  Top 0.203: IC6.5 30.68,11 29.21,9.53 JP1.8
MCLK  (via drill 0.35)
  Top 0.203: R3.2 14.87,24.13 v22.54,24.13 | JP1.4 19.05,6.35 20.32,7.62 23.18,7.62 24.77,9.21 24.77,21.91 v22.54,24.13 | IC6.46 26.2,30 25.72,29.52 25.72,28.57 25.08,27.94 24.45,27.94 23.81,27.3 v23.81,26.35 | v22.54,24.13 22.54,23.5 21.91,22.86 R2.2
  Bottom 0.203: v23.81,26.35 23.81,25.4 v22.54,24.13
N$1
  Top 0.813: R32.1 JP2.1
N$2
  Top 0.813: R33.1 JP2.4
N$3
  Top 0.305: IC9.5 R7.2 10.16,62.23 10.16,59.32 C39.1 R11.2
N$4
  pour Top (rank 3): 27.62,34.77 26.67,34.77 26.67,28.89 27.62,28.89
N$5
  pour Top (rank 3): 34.45,27.15 34.45,28.1 28.42,28.1 28.42,26.99 34.45,26.99
N$6
  pour Top (rank 3): 35.24,28.73 36.2,28.73 36.2,34.77 35.24,34.77
N$7
  pour Top (rank 3): 34.29,35.56 34.29,36.51 28.57,36.51 28.57,35.56
N$8
  Top 0.305: D3.1 R19.1
  Top 0.813: Q7.3 D3.1
N$9
  Top 0.305: D3.2 44.45,63.5 43.18,64.77 IC10.7
  Bottom 0.305: D3.2 48.26,64.77 55.88,64.77 D4.1
N$10
  Top 0.305: 59.53,63.34 D4.2 R21.2
  Top 0.813: Q8.3 59.53,63.34
N$13
  Top 0.279: IC6.38 26.37,34 26.04,34.34 26.04,34.92 26.93,35.83 C15.1
  Top 0.508: C15.1 26.93,37.52 22.86,41.59 C12.+
N$14
  Bottom 0.813: SW1.3 76.36,76.04 73.66,73.34 73.66,70.17 72.07,68.58 R29.2
N$20
  Top 0.813: Q7.1 53.34,62.23 53.34,67.31 R26.2
N$21
  Top 0.305: IC9.6 R10.1 13.97,61.33 C38.2 R6.2
N$22
  Top 0.279: IC6.1 28.68,26.78 27.25,25.35 26.93,25.35
  Top 0.305: 26.93,25.35 C19.1
N$23
  Top 0.279: IC6.23 35.72,34.03 36.52,34.03 36.83,34.34 36.83,34.92 35.93,35.83 C24.1
  Top 0.508: C26.+ 40.01,41.59 37.73,39.32 37.73,38.52 35.93,36.72 C24.1
N$28
  Top 0.813: Q8.1 62.23,66.04 R27.1
N$29  (via drill 0.35 pad 0.55)
  Top 0.305: R15.2 40.64,58.79 C45.1 v43.18,58.42 | R26.1 v54.61,59.69
  Top 0.813: R26.1 R27.2 58.42,69.85 60.96,69.85 R29.1
  Bottom 0.305: v54.61,59.69 53.34,58.42 v43.18,58.42
N$30
  Top 0.813: R25.1 58.42,74.93 Q6.1
N$31
  Top 0.813: Q5.1 48.26,76.2 50.8,73.66 R24.2
N$32  (via drill 0.35 pad 0.55)
  Top 0.305: R24.1 55.88,74.93 v55.88,83.82 | v44.45,83.82 43.15,82.52 43.15,81.62 C44.1 43.18,80.91 R14.2
  Top 0.813: R24.1 R25.2 58.42,72.39 60.96,72.39 R28.2
  Bottom 0.305: v55.88,83.82 v44.45,83.82
N$41
  Top 0.305: C38.1 16.51,61.33 R10.2 | R10.2 IC9.7 | R10.2 R13.1
N$42
  Top 0.305: IC9.3 R5.2 12.7,77.47 12.7,80.38 C37.1 13.97,81.28 14.29,81.28 R9.2
N$43
  Top 0.305: R4.2 C36.2 16.88,76.57 R8.1 IC9.2
N$44
  Top 0.305: IC9.1 R8.2 19.05,78.37 C36.1 31.11,78.74 33.02,76.83 R12.1
N$45
  Top 0.305: R12.2 37.73,76.2 C42.1 38.47,76.2 R16.1 R14.1
N$46
  Top 0.305: C43.1 35.56,61.33 R13.2 R17.1 R15.1
N$47
  Top 0.305: IC10.6 R17.2 39.37,62.23 39.37,59.69 38.47,58.79 C45.2
N$48
  Top 0.305: C44.2 41.91,80.38 41.91,77.47 R16.2 IC10.2
N$60
  Top 0.305: D1.1 R18.1
  Top 0.813: D1.1 Q5.3
N$62
  Bottom 0.813: SW1.4 67.53,73.66 R28.1
N$63
  Bottom 0.61: IC13.1 83.55,50.53 C53.1 80.6,50.53 77.79,53.34 74.61,53.34 73.34,54.61 73.34,55.55 D5.K 70.07,55.88 SW1.6
N$64
  Top 0.305: D2.2 R20.2
  Top 0.813: D2.2 Q6.3
N$65
  Bottom 0.813: JP4.4 79.38,80.64 79.38,73 SW1.2
N$66
  Bottom 0.61: SW1.1 75.07,56.04 D5.A 74.91,56.85 74.3,57.47 73.03,57.47 71.83,58.67 Q9.3
N$67
  Bottom 0.813: JP4.1 71.12,78.74 71.75,78.11 71.75,72.89 SW1.5
N$68
  Bottom 0.305: R31.1 83.56,61.23 R30.2 74.28,61.23 Q9.1
N$75
  Bottom 0.305: IC10.1 45.72,77.47 46.99,78.74 D1.2 52.07,77.47 54.61,77.47 55.88,78.74 D2.1
N$83
  Top 0.203: R2.1 19.42,21.52 X1.3
N$86
  Top 0.203: R3.1 11.8,21.52 X2.3
N$91
  Top 0.508: IC1.1 5.08,25.56
  Top 0.813: 5.08,25.56 R1.2
  Bottom 0.508: C1.1 8.62,25.4 IC1.1
OPA_+
  Top 0.305: TP4.1 24.13,65.41
  Top 0.813: IC9.8 19.68,65.41 24.13,65.41 C32.+ 30.8,65.41 33.97,68.58 44.45,68.58 45.72,67.31 IC10.8
  Bottom 0.813: C32.+ 24.45,65.41 21.59,62.55 IC7.3 24.08,60.96 C30.1 | IC10.8 47.26,66.04 C40.1 | IC9.8 21.22,66.04 C34.1
OPA_-
  Top 0.305: TP3.1 32.38,73.66
  Top 0.813: IC9.4 11.43,72.39 12.7,71.12 21.59,71.12 25.4,74.93 C33.- 28.89,74.93 30.16,73.66 32.38,73.66 IC10.4
  Bottom 0.813: C33.- 28.89,74.93 30.48,73.34 30.48,63.82 29.53,62.87 IC8.3 26.72,60.96 C31.2 | C41.2 37.73,73.29 IC10.4 | IC9.4 9.26,73.66 C35.2
OUT_EN  (via drill 0.35)
  Top 0.305: JP1.13 41.91,7.62 45.72,11.43 59.69,11.43 63.5,15.24 63.5,25.4 67.31,29.21 v78.11,29.21
  Bottom 0.305: R31.2 86.36,50.8 86.36,35.56 80.01,29.21 v78.11,29.21
SCK
  Top 0.203: IC6.3 29.68,11.27 24.13,5.71 JP1.6
V+  (via drill 0.6)
  Top 0.813: IC7.1 26.04,51.44 50.48,51.44 61.28,40.64 | IC11.1 61.28,40.64 | 61.28,40.64 61.28,32.7 | 61.28,32.7 61.28,31.75 | C9.+ 47.04,16.25 C10.1 55.62,16.25 IC5.1 59.37,16.51 61.28,18.41 61.28,30.48 | R32.2 83.82,21.59 C54.+ v78.11,31.75 v76.2,31.75 v74.61,31.75 62.55,31.75 | 62.23,31.75 61.28,31.75 | 61.28,30.48 61.28,31.75 | 61.28,30.48 62.55,31.75 | 61.28,32.7 62.23,31.75 | 62.23,31.75 62.55,31.75
  Bottom 0.61: C52.1 82.92,44.82 IC13.3
  Bottom 0.813: IC7.1 21.59,55.62 C28.1 | C52.1 81.28,34.61 78.42,31.75 v78.11,31.75 v76.2,31.75 v74.61,31.75 | IC11.1 63.5,37.2 C46.1
V-
  Top 0.813: IC8.2 32.38,58.42 38.1,52.7 51.12,52.7 59.37,44.45 73.98,44.45 76.2,42.23 IC12.2 | C55.- 67.94,22.23 R33.2
  Bottom 0.813: IC8.2 32.38,58.42 32.38,58.37 C29.2 | IC12.2 76.2,37.2 C47.2 75.83,35.19 74.93,34.29 71.12,34.29 69.85,33.02 69.85,27.94 C55.-
XTAL_VCC
  Top 0.508: X2.4 10.6,13.9 C4.1 | X1.4 18.22,13.9 C3.1 17.83,11.11 12.75,11.11 11.8,12.06 C4.1 | C4.1 7.94,12.7 4.71,15.92 C2.1 4.71,19.95 IC1.3

### Text on the board
tPlace: Audio DAC ver 4